# Altium schematic sheet ALLEGRO_CONNECTOR.SchDoc
size Letter; SheetNumber: 5; SheetTotal: 15; SPICEModelCacheFIYDHHWJ: <root> / <DocumentId>FIYDHHWJ</DocumentId> / <CacheFrame Number="0"> / <Model Name="umk325b7475_n-tr" Kind="CKT"> / <Text>* UMK325B7475_N-TR     SPICE MODEL  ( General Type ) / *-------------------------------------------------------------------------------------------------------- / * Model Generated by TAIYO YUDEN Corporation (http://www.ty-top.com) / * Version 1.0 / * TAIYO YUDEN Control No. 170508_110722 / * Copyright(c) 2012 TAIYO YUDEN CO.,LTD. All Rights Reserved. / *-------------------------------------------------------------------------------------------------------- / * / * Products Name : Multilayer Ceramic Capacitors / * / * Characteristics : / *     Capacitance : 4.7 uF , Rated Voltage : 50V , TCC : X7R / *     Case Size : 3.2 x 2.5 / 0.126 x 0.098 [mm/inch] , Thickness : 1.9 / 0.075 [mm/inch] / *     (Conditions: Temperature = 25 degC , DC Bias Current/Voltage = 0A / 0V) / * / * Frequency Range : 40Hz - 3GHz / * / * External Node Assignments : / * / *  1  o---| |---o  2 / * / *-------------------------------------------------------------------------------------------------------- / .SubCkt UMK325B7475_N-TR 1 2 / **************************** / C0 1 110 4.2842u / Cm 1 101 0.26769u / Rc1 101 102 1.3219 / C2 102 103 0.15728u / Rc2 102 103 266.31 / C3 103 110 22.789p / Rc3 103 110 35.595 / C2m 1 301 0.28635u / Rc21 301 302 14.59 / C22 302 303 1.5087u / Rc22 302 303 1.0546k / C23 303 304 0.049481u / Rc23 303 304 2.7033k / C24 304 305 0.062261u / Rc24 304 305 2.0733k / C25 305 110 58.302p / Rc25 305 110 991.63 / Rp0 1 110 106.382978723404Meg / L0 110 120 0.2425n / Lm 120 130 0.37058n / L1 120 121 0.44043n / RL1 121 130 0.21947 / L2 120 122 1.079n / RL2 122 130 0.54298 / L3 120 123 1.1393n / RL3 123 130 0.57182 / CR 120 124 0.72832u / LR 124 125 0.42802n / RR 125 130 36.415m / CL 130 140 14.134p / LL 130 140 0.20042n / RL 130 140 6.3872 / Rs 140 2 5.0797m / **************************** / .ends UMK325B7475_N-TR</Text> / </Model> / </CacheFrame> / </root>
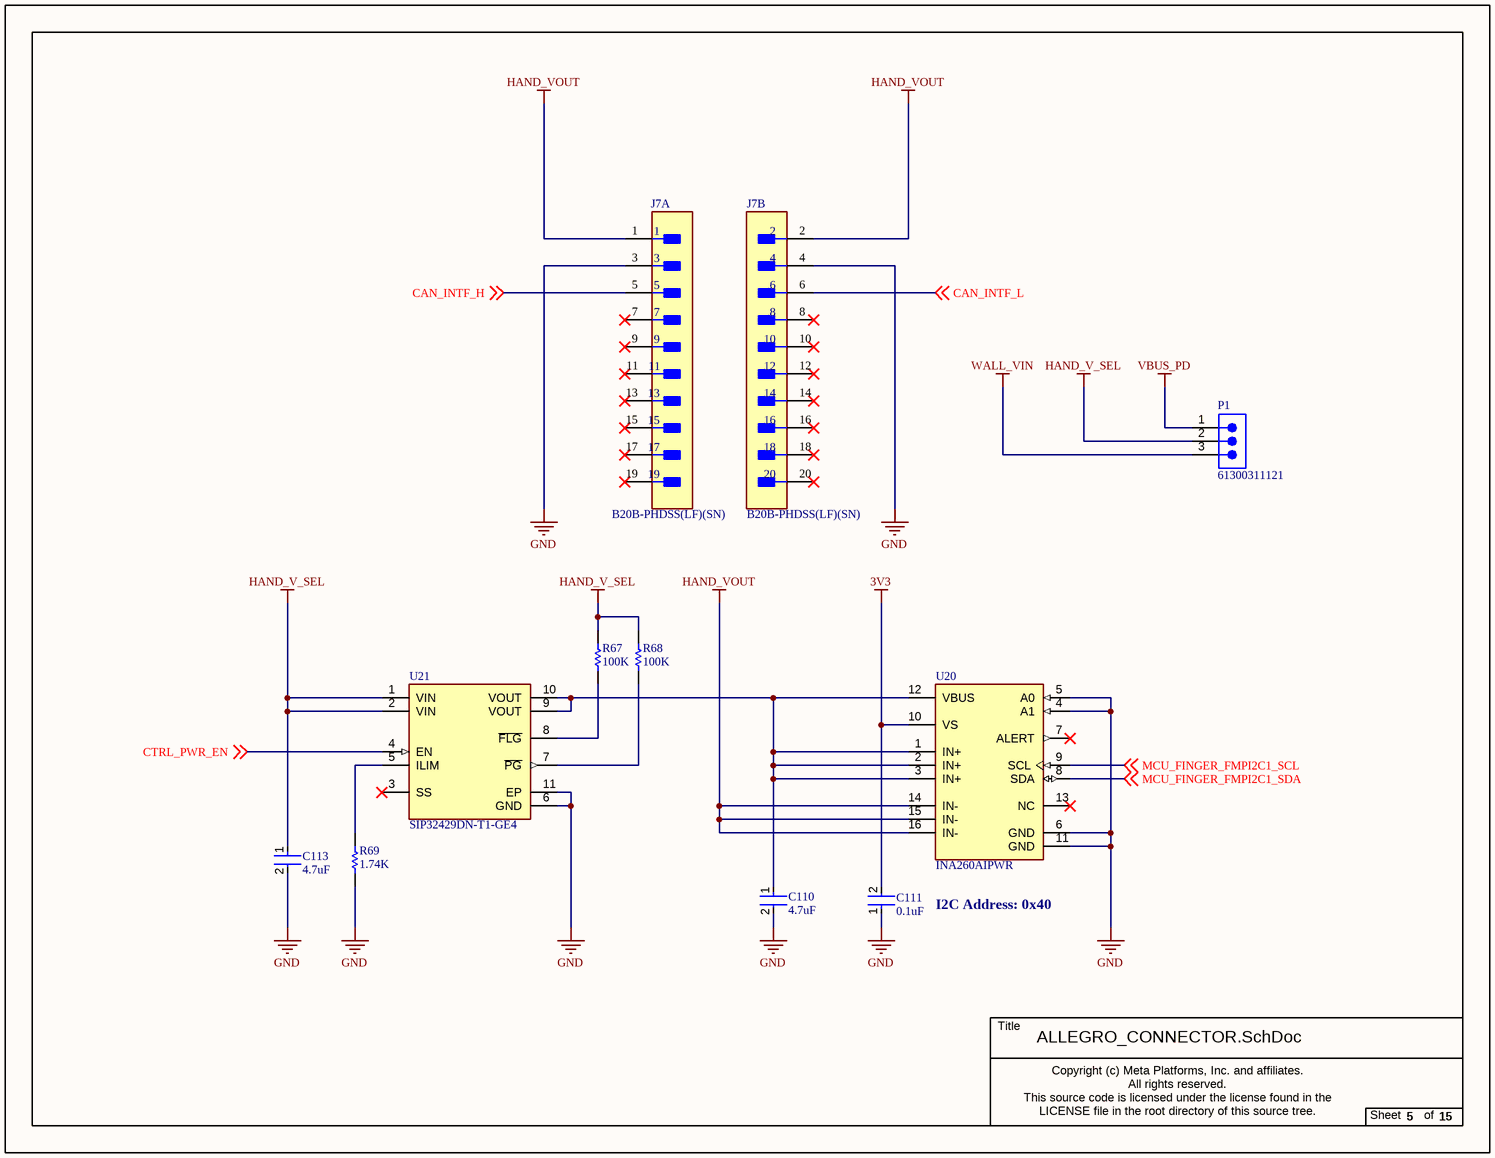
[diagram p0: ALLEGRO_CONNECTOR.SchDoc]

## Parts
C110  4.7uF  [FP-1210-L_3_2_0_3-W_2_5_0-IPC_B]
C111  0.1uF  [FP-CC0201-BA-MFG]
C113  4.7uF  [FP-1210-L_3_2_0_3-W_2_5_0-IPC_B]
J7  B20B-PHDSS(LF)(SN)  [FP-B20B-PHDSS_LF_SN-MFG]  (parts A,B of 2)
P1  61300311121  [61300311121]
R67  100K  [RESC1005X40X25NL05T10]
R68  100K  [RESC1005X40X25NL05T10]
R69  1.74K  [RESC1005X35X20ML05T10]
U20  INA260AIPWR  [FP-PW0016A-MFG]
U21  SIP32429DN-T1-GE4  [FP-S-42134-IPC_C]

## Nets
3V3: C111.2 U20.10(VS)
GND: C110.2 C111.1 C113.2 J7.3 J7.4 R69.1 U20.4(A1) U20.5(A0) U20.6(GND) U20.11(GND) U21.6(GND) U21.11(EP)
HAND_V_SEL: C113.1 P1.2 R67.2 R68.2 U21.1(VIN) U21.2(VIN)
HAND_VOUT: J7.1 J7.2 U20.14(IN-) U20.15(IN-) U20.16(IN-)
VBUS_PD: P1.1
WALL_VIN: P1.3
CAN_INTF_H: J7.5 ; off-sheet CAN_INTF_H
CAN_INTF_L: J7.6 ; off-sheet CAN_INTF_L
CTRL_PWR_EN: U21.4(EN) ; off-sheet CTRL_PWR_EN
MCU_FINGER_FMPI2C1_SCL: U20.9(SCL) ; off-sheet MCU_FINGER_FMPI2C1_SCL
MCU_FINGER_FMPI2C1_SDA: U20.8(SDA) ; off-sheet MCU_FINGER_FMPI2C1_SDA
NetC110_1: C110.1 U20.1(IN+) U20.2(IN+) U20.3(IN+) U20.12(VBUS) U21.9(VOUT) U21.10(VOUT)
NetR67_1: R67.1 U21.8(~{FLG})
NetR68_1: R68.1 U21.7(~{PG})
NetR69_2: R69.2 U21.5(ILIM)

Not connected (* = marked no-connect by the designer): J7 7* 8* 9* 10* 11* 12* 13* 14* 15* 16* 17* 18* 19* 20*; U20 7(ALERT)* 13(NC)*; U21 3(SS)*

## Notes on the sheet
- I2C Address: 0x40
- Title
- Copyright (c) Meta Platforms, Inc. and affiliates.
  All rights reserved.
  This source code is licensed under the license found in the
  LICENSE file in the root directory of this source tree.
- Sheet
- of

## Library data of the parts
C110 C113 = CMP-14477-001522-2: None; RoHS Compliant: Yes
C111 = CMP-03422-000376-1: CAP CER 0.1UF 6.3V X5R 0201; Manufacturer: Yageo; Manufacturer Part Number: CC0201KRX5R5BB104; Tolerance: 0.1; Temperature Coefficient: 15%; Value: 100 nF; Material: Ceramic; Automotive: No; Device Class L2: Capacitors; Temperature Range High: +85°C; Capacitance: 100 nF; Temperature: -55°C to +85°C; ComponentLink2URL: http://www.yageo.com/documents/recent/UPY-GPHC_X5R_4V-to-50V_25.pdf; Category: Cap; Mouser Description: Multilayer Ceramic Capacitors MLCC - SMD/SMT 100nF 6.3V X5R 10%; Ipc Land Pattern Name: CAPC6030X30; Temperature Characteristic: X5R; Voltage Rating: 6.3 V; Lead Free: Yes; Digikey Description: CAP CER 0.1UF 6.3V X5R 0201; Device Class L1: Passive Components; Octopart: https://octopart.com/cc0201krx5r5bb104-yageo-9292636; Height: 0.33mm; Package: CC0201-BA; Footprint Url: http://www.yageo.com/exep/pages/download/literatures/UPY-C_GEN_24.pdf; ComponentLink2Description: Datasheet; Device Class L3: Ceramic Capacitors; Temperature Range Low: -55°C; RoHS: TRUE
J7 = CMP-17439-000286-1: CONN HEADER VERT 20POS 2MM; Contact Resistance: 20mR; Current Rating: 3A; Number of Positions: 20; Gender: Male; Row Spacing: 0.079inch; Max Voltage Rating (DC): 250V; Mated Stacking Heights: 8.8mm; Contact Mating Length: 0.13inch; Lead Free: Lead Free; Pitch: 2mm; Fastening Type: Detent; Contact Shape: Square; Contact Type: Male Pin; Series: PHD; Max Current Rating: 3A; Housing Material: Polyamide; Width: 5mm; Depth: 5mm; Housing Color: Beige; Number of Contacts: 20; Flammability Rating: UL94 V-0; Insulation Color: Natural; Number of Rows: 2; Mount: Through Hole; Termination: Solder; Height: 9.5mm; Voltage Rating: 250V; Contact Finish - Mating: TIN; Color: Natural; Contact Plating: Copper; Min Operating Temperature: -25°C; Insulation Material: Nylon; Orientation: Straight; Max Operating Temperature: 85°C; Max Voltage Rating (AC): 250V; Length: 21.9mm; Packaging: Bulk; Connector Type: Header; Contact Material: Copper Alloy
P1 = CMP-1502-01062-2: NexarPartId: 32855521; Voltage Rating: 250V; Current Rating: 3A; Connector Type: Male Pin; Number of Positions: 3; Gender: Male; Contact Resistance: 20mΩ; Pitch: 2.54mm; Max Operating Temperature: 105°C; Lead Pitch: 2.54mm; Lead Free: Lead Free; Contact Mating Length: 5.9944mm; Contact Material: Copper; Number of Pins: 3; Orientation: Vertical; Height: 8.94mm; Packaging: Bulk; Min Operating Temperature: -40°C; Mount: Through Hole; RoHS: Compliant; Number of Contacts: 3; Operating Supply Voltage: 250V; Termination: Solder; Number of Rows: 1; Contact Plating: Gold; Color: Black; REACH SVHC: Unknown
R67 R68 = CMP-2002-07343-1: Part Number: RC0402FR-07100KL; Manufacturer: Yageo / Phycomp
R69 = CMP-2002-03190-1: Manufacturer: TE Connectivity / AMP; Part Number: CPF0402B1K74E1
U20 = CMP-04910-000015-1: IC MONITOR PWR/CURR 16TSSOP; Manufacturer: Texas Instruments; Nominal Supply Current: 310uA; Max Junction Temp: +150°C; Standoff Height: 0.05mm; Max Supply Voltage: 5.5V; Min Supply Voltage: 2.7V; Output Current: 10mA; Ambient Temperature Range High: +125°C; ComponentLink2Description: Datasheet; Manufacturer Part Number: INA260AIPWR; Automotive: No; RoHS: TRUE; Lead Free: Yes; Package: PW0016A; Device Class L2: Power Management ICs; Temperature Range Low: -40°C; Digikey Description: IC MONITOR PWR/CURR 16TSSOP; Height: 1.2mm; Temperature: -40°C to +125°C; Device Class L1: Integrated Circuits (ICs); Device Class L3: unset; Octopart: https://octopart.com/ina260aipwr-texas+instruments-75199489; Category: IC; Ambient Temperature Range Low: -40°C; Temperature Range High: +125°C; ComponentLink2URL: http://www.ti.com/lit/ds/symlink/ina260.pdf
U21 = CMP-02501-000003-1: IC PWR SWITCH P-CHAN 1:1 10DFN; Turn-Off Delay Time: 1us; Output Configuration: High Side; Number of Outputs: 1; Fault Protection: Over Temperature; Max Supply Voltage: 28V; On-State Resistance: 56mR; Min Supply Voltage: 6V; Max Output Current: 3.5A; Turn-On Delay Time: 550us; Max Power Dissipation: 1.42W; Interface: On/Off; Max Operating Temperature: 85°C; Radiation Hardening: No; Min Operating Temperature: -40°C; Number of Pins: 10; Package Quantity: 2500; Case/Package: DFN; Weight: 0.001764oz; Packaging: Tape and Reel; Mount: Surface Mount